# EAGLE design Si4455 Breakout (EAGLE 6.4)
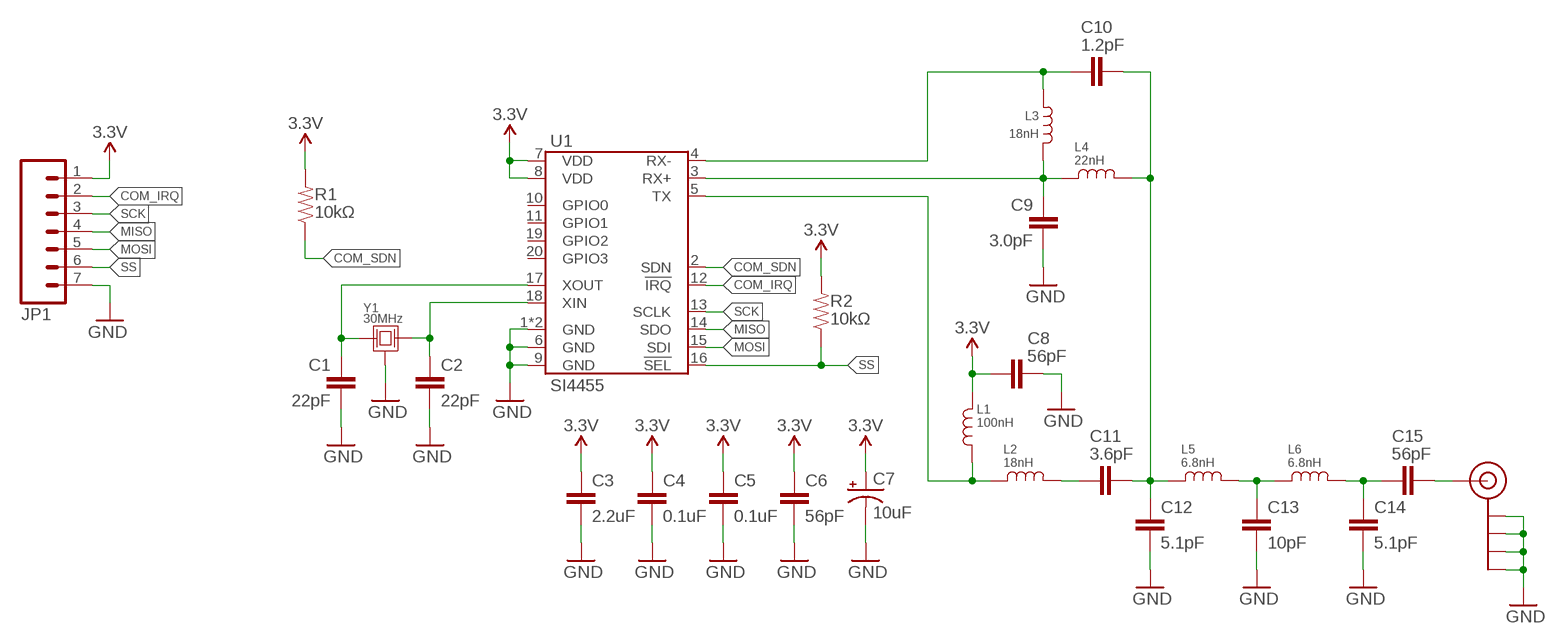
[diagram p0: schematic, sheet 1]

## Parts
C1  22pF  CAP-0402  [0402-CAP]
C2  22pF  CAP-0402  [0402-CAP]
C3  2.2uF  CAP-0402  [0402-CAP]
C4  0.1uF  CAP-0402  [0402-CAP]
C5  0.1uF  CAP-0402  [0402-CAP]
C6  56pF  CAP-0402  [0402-CAP]
C7  10uF  CAP_POL0805  [0805-CAP_POL]
C8  56pF  CAP-0402  [0402-CAP]
C9  3.0pF  CAP-0402  [0402-CAP]
C10  1.2pF  CAP-0402  [0402-CAP]
C11  3.6pF  CAP-0402  [0402-CAP]
C12  5.1pF  CAP-0402  [0402-CAP]
C13  10pF  CAP-0402  [0402-CAP]
C14  5.1pF  CAP-0402  [0402-CAP]
C15  56pF  CAP-0402  [0402-CAP]
J$1  SMA_EDGE  [SMA-EDGE]
JP1  M07  [1X07]
L1  100nH  INDUCTOR-0402  [0402-INDUCTOR]
L2  18nH  INDUCTOR-0402  [0402-INDUCTOR]
L3  18nH  INDUCTOR-0402  [0402-INDUCTOR]
L4  22nH  INDUCTOR-0402  [0402-INDUCTOR]
L5  6.8nH  INDUCTOR-0402  [0402-INDUCTOR]
L6  6.8nH  INDUCTOR-0402  [0402-INDUCTOR]
R1  10kΩ  RESISTOR  [0402-RES]
R2  10kΩ  RESISTOR  [0402-RES]
U1  SI4455  [SI4455]
Y1  30MHz  CRYSTAL-3.2X2.5  [FA-238]

## Nets
3.3V: C3.1 C4.1 C5.1 C6.1 C7.A(+) C8.1 JP1.1 L1.2 R1.2 R2.2 U1.7(VDD) U1.8(VDD)
COM_IRQ: JP1.2 U1.12(!IRQ)
COM_SDN: R1.1 U1.2(SDN)
GND: C1.2 C2.2 C3.2 C4.2 C5.2 C6.2 C7.C(-) C8.2 C9.2 C12.2 C13.2 C14.2 J$1.GND@0(GND) J$1.GND@1(GND) J$1.GND@2(GND) J$1.GND@3(GND) JP1.7 U1.1(GND) U1.6(GND) U1.9(GND) U1.EP(GND) Y1.2(GND) Y1.4(GND)
MISO: JP1.4 U1.14(SDO)
MOSI: JP1.5 U1.15(SDI)
N$3 [rf]: C15.2 J$1.SIG(SIGNAL)
N$5 [rf]: C14.1 C15.1 L6.2
N$6 [rf]: C13.1 L5.2 L6.1
N$8 [rf]: C11.1 L2.2
N$9: L1.1 L2.1 U1.5(TX)
N$10: C10.1 L3.2 U1.4(RX-)
N$11: C1.1 U1.17(XOUT) Y1.1
N$12: C2.1 U1.18(XIN) Y1.3
N$13: C9.1 L3.1 L4.1 U1.3(RX+)
N$14 [rf]: C10.2 C11.2 C12.1 L4.2 L5.1
SCK: JP1.3 U1.13(SCLK)
SS: JP1.6 R2.1 U1.16(!SEL)
Unconnected: U1.10(GPIO0) U1.11(GPIO1) U1.19(GPIO2) U1.20(GPIO3)

## Library data of the parts
C1-C6 C8-C15 = Passives:CAP
C7 = SparkFun-Passives:CAP_POL: Capacitor Polarized These are standard SMD and PTH capacitors. Normally 10uF, 47uF, and 100uF in electrolytic and tantalum varieties. Always verify the external diameter of the through hole cap, it varies with capacity, voltage, and manufacturer. The EIA devices should be standard.
J$1 = SparkFun-Connectors:SMA_EDGE: SMA Antenna Connector End launch SMA connector. The paste layer has been removed so that the connector can be hand soldered onto the board after reflow.
JP1 = SparkFun-Connectors:M07: Header 7 Standard 7-pin 0.1" header. Use with straight break away headers (SKU : PRT-00116), right angle break away headers (PRT-00553), swiss pins (PRT-00743), machine pins (PRT-00117), and female headers (PRT-00115). NOTES ON THE VARIANTS LOCK and LOCK_LONGPADS... This footprint was designed to help hold the alignment of a through-hole component (i.e. 7-pin header) while soldering it into place. You may notice that each hole has been shifted either up or down by 0.005 of an inch from it's more standard position (which is usually a perfectly straight line). This slight alteration caused the pins (the squares in the middle) to touch the edges of the holes. Because they are alternating, it causes a "brace" to hold the header in place. 0.005 has proven to be the perfect amount of "off-center" position when using our standard breakaway headers. Although looks a little odd when you look at the bare footprint, once you have a header in there, the alteration is very hard to notice. Also, if you push a header all the way into place, it is covered up entirely on the bottom side. This idea of altering the position of holes to aid alignment will be further integrated into the Sparkfun Library for other footprints. It can help hold any component with 3 or more connection pins.
L1-L6 = Passives:INDUCTOR
R1 R2 = Passives:RESISTOR
U1 = Silicon Labs:SI4455
Y1 = Passives:CRYSTAL

## Net classes
1 rf: width 0.584 mm, drill 0.406 mm, clearance 0.4 mm

## Board
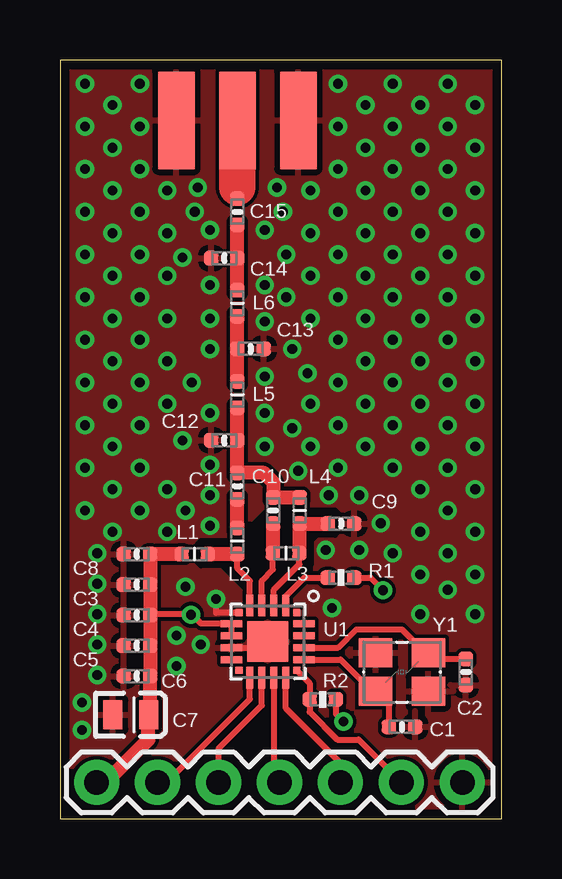
[diagram p1: board, top side]
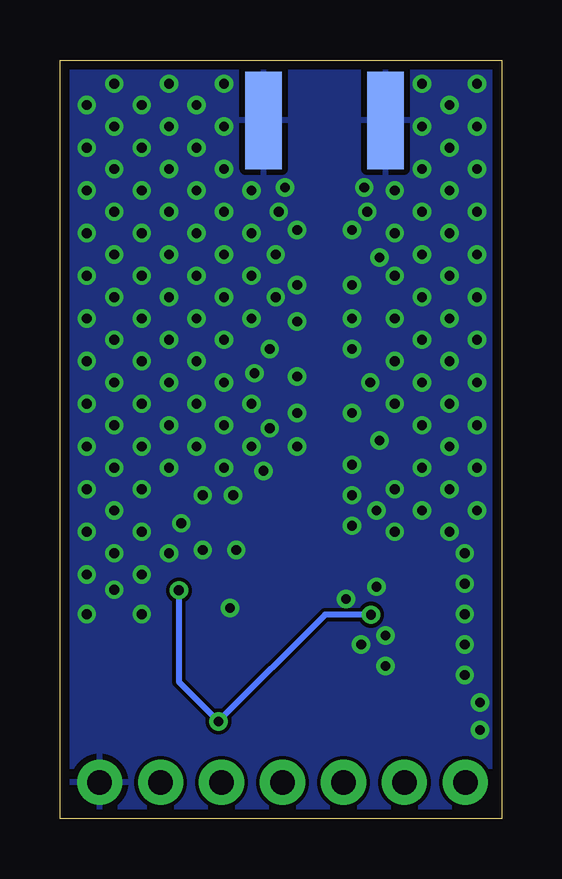
[diagram p2: board, bottom side, seen from below]

Size 18.41 x 31.62 mm. Coordinates in mm from the lower left corner, seen from the top.
Outline: 0,0 18.41,0 18.41,31.62 0,31.62 0,0
Copper layers (1*16): Top 0.0356mm / dielectric 1.5011mm / Bottom 0.0356mm
Design rules "LaenPCBOrder *": minimum track width 6mil, minimum drill 13mil, track to track 6mil, track to pad 6mil, pad to pad 6mil, via to via 6mil, smd to smd 6mil, copper to edge 15mil, drill to drill 6mil, minimum pad ring 7mil, minimum via ring 7mil, stop-mask expansion 4mil, vias tented up to drill 17mil, thermal gap 10mil

### Footprints (pad centres in the part's own frame; a part is rotated, then mirrored left to right if it is on the bottom)
0402-CAP = smd 0.6 x 0.6: 1 -0.55,0; 2 0.55,0
0805-CAP_POL = smd 0.8 x 1.2: A 0.75,0; C -0.75,0
SMA-EDGE = smd 1.524 x 4.064: GND@0 0,0; GND@1 5.08,0; SIG 2.54,0 | smd 1.524 x 4.064 bottom: GND@2 0,0; GND@3 5.08,0
1X07 = drill 1.016 pad 1.88: 1 0,0; 2 2.54,0; 3 5.08,0; 4 7.62,0; 5 10.16,0; 6 12.7,0; 7 15.24,0
0402-INDUCTOR = smd 0.6 x 0.6: 1 -0.55,0; 2 0.55,0
0402-RES = smd 0.6 x 0.6: 1 -0.55,0; 2 0.55,0
SI4455 = smd 0.3 x 0.3: 1 -1.2,1.2; 6 -1.2,-1.2; 11 1.2,-1.2; 16 1.2,1.2 | smd 0.9 x 0.29: 2 -1.51,0.75; 3 -1.51,0.25; 4 -1.51,-0.25; 5 -1.51,-0.75; 12 1.51,-0.75; 13 1.51,-0.25; 14 1.51,0.25; 15 1.51,0.75 | smd 0.29 x 0.9: 7 -0.75,-1.51; 8 -0.25,-1.51; 9 0.25,-1.51; 10 0.75,-1.51; 17 0.75,1.51; 18 0.25,1.51; 19 -0.25,1.51; 20 -0.75,1.51 | smd 1.7 x 1.7: EP 0,0
FA-238 = smd 1.4 x 1.2: 1 -1.1,-0.8; 2 1.1,-0.8; 3 1.1,0.8; 4 -1.1,0.8

### Placement (x,y rotation side)
C1  14.25,3.84 0 top
C2  16.92,6.12 270 top
C3  3.2,9.77 180 top
C4  3.2,8.5 180 top
C5  3.2,7.23 180 top
C6  3.2,5.96 180 top
C7  2.95,4.34 0 top
C8  3.2,11.04 180 top
C9  11.71,12.31 0 top
C10  8.88,12.85 90 top
C11  7.39,13.87 90 top
C12  6.85,15.77 180 top
C13  7.94,19.58 0 top
C14  6.85,23.37 180 top
C15  7.39,25.3 90 top
J$1  4.85,29.11 0 top
JP1  1.52,1.52 0 top
L1  5.61,11.04 180 top
L2  7.39,11.58 90 top
L3  9.42,11.07 180 top
L4  9.98,12.85 90 top
L5  7.39,17.68 90 top
L6  7.39,21.49 90 top
R1  11.71,10.06 0 top
R2  10.95,4.98 0 top
U1  8.66,7.39 270 top
Y1  14.25,6.12 0 top

### Tracks (layer width: path | path; a pad name or v marks a point on that pad's centre or on a via)
3.3V  (via drill 0.41)
  Top 0.254: 5.49,8.53 5.88,8.14 U1.7 U1.8 | 5.49,8.53 3.79,8.53 C4.1 | R2.2 11.5,4.38 v11.81,4.06 | R1.2 12.93,10.06 v13.46,9.53 | 5.49,8.53 v5.46,8.51
  Top 0.584: L1.2 C8.1 C3.1 C4.1 C5.1 C6.1 3.75,4.4 C7.A 3.68,4.33 3.68,3.3 1.91,1.52 JP1.1
  Bottom 0.254: v13.46,9.53 13.46,5.71 v11.81,4.06 7.37,8.51 v5.46,8.51
COM_IRQ
  Top 0.254: U1.12 7.91,4.99 4.45,1.52 JP1.2
COM_SDN
  Top 0.254: U1.2 9.41,9.28 10.19,10.06 R1.1
GND  (via drill 0.41)
  Top 0.254: U1.6 6.5,8.59 v6.5,9.17 | U1.9 8.41,7.14 U1.EP
  other vias: 5.23,9.68 9.04,26.31 5.74,26.31 6.25,24.54 8.53,24.54 8.53,22.25 6.25,22.25 5.11,23.39 8.53,20.73 9.68,19.58 6.25,19.58 8.53,18.44 8.53,16.92 6.25,16.92 5.11,15.77 8.53,15.52 9.93,14.5 11.2,13.49 12.47,13.49 13.36,12.32 12.47,11.2 11.07,11.2 5.87,7.26 4.85,7.65 4.85,6.38 1.55,5.99 1.55,7.26 1.55,8.53 1.55,9.8 1.55,11.07 2.18,11.96 4.47,13.74 6.25,12.22 6.25,14.76 3.33,30.63 3.33,28.85 3.33,27.08 4.47,26.19 10.44,26.19 11.33,8.79 15.01,8.53 6.25,13.49 1.04,30.63 1.04,28.85 1.04,27.08 2.18,29.74 2.18,27.97 1.04,25.3 3.33,25.3 2.18,26.19 13.87,30.63 13.87,28.85 13.87,27.08 11.58,30.63 11.58,28.85 11.58,27.08 12.73,29.74 12.73,27.97 11.58,25.3 13.87,25.3 12.73,26.19 16.15,30.63 16.15,28.85 16.15,27.08 15.01,29.74 15.01,27.97 16.15,25.3 15.01,26.19 17.3,29.74 17.3,27.97 17.3,26.19 9.3,25.3 10.44,24.41 12.73,24.41 15.01,24.41 17.3,24.41 4.47,24.41 5.61,25.3 2.18,24.41 3.33,23.52 1.04,23.52 2.18,22.63 4.47,22.63 2.18,20.85 1.04,21.74 3.33,21.74 1.04,19.96 4.47,20.85 2.18,19.08 4.47,19.08 3.33,19.96 6.25,20.85 3.33,18.19 1.04,18.19 2.18,17.3 4.47,17.3 5.49,18.19 3.33,16.41 1.04,16.41 2.18,15.52 3.33,14.63 1.04,14.63 2.18,13.74 1.04,12.85 3.33,12.85 4.47,11.96 5.23,12.85 17.3,10.19 17.3,11.96 16.15,11.07 13.87,11.07 15.01,11.96 17.3,22.63 16.15,23.52 13.87,23.52 11.58,23.52 9.42,23.52 15.01,22.63 12.73,22.63 10.44,22.63 16.15,21.74 13.87,21.74 11.58,21.74 9.42,21.74 16.15,12.85 17.3,13.74 17.3,15.52 17.3,17.3 17.3,19.08 17.3,20.85 15.01,20.85 16.15,19.96 16.15,18.19 16.15,16.41 16.15,14.63 15.01,13.74 15.01,15.52 15.01,17.3 15.01,19.08 12.73,20.85 10.44,20.85 13.87,19.96 11.58,19.96 12.73,19.08 13.87,18.19 13.87,16.41 13.87,14.63 12.73,17.3 12.73,15.52 11.58,18.19 11.58,16.41 11.58,14.63 10.44,17.3 10.44,15.52 10.31,18.57 9.68,16.28 15.01,10.19 16.15,9.55 17.3,8.53 0.91,4.85 0.91,3.71
  pour Top: -1.27,-1.27 19.56,-1.27 19.56,32.89 -1.27,32.89
  pour Bottom: -2.54,34.16 20.83,34.16 20.83,-2.54 -2.54,-2.54
MISO
  Top 0.254: U1.14 8.91,1.75 JP1.4
MOSI
  Top 0.254: U1.15 9.41,4.61 11.68,2.34 JP1.5
N$3
  Top 0.584: C15.2 7.39,26.31
  Top 1.511: 7.39,26.31 J$1.SIG
N$5
  Top 0.584: L6.2 C14.1 C15.1
N$6
  Top 0.584: L5.2 C13.1 L6.1
N$7
  cutout Top: 5.87,11.58 7.39,11.58 8.66,12.85 11.46,12.85 11.71,12.6 11.71,12.09 11.46,11.84 10.69,11.84 10.44,11.58 10.44,10.57 9.3,9.42 7.9,9.42 6.76,10.57 5.87,10.57 5.61,10.82 5.61,11.33
N$8
  Top 0.584: L2.2 C11.1
N$9
  Top 0.254: U1.5 7.91,9.92 7.39,10.44 L2.1
  Top 0.584: L2.1 L1.1
N$10
  Top 0.254: U1.4 8.41,9.94 8.87,10.4 L3.2
  Top 0.584: C10.1 L3.2
N$11
  Top 0.254: U1.17 11.7,6.64 12.6,5.74 12.73,5.74 Y1.1 13.7,4.77 C1.1
N$12
  Top 0.254: U1.18 11.59,7.14 12.34,7.9 14.25,7.9 14.88,7.26 15.01,7.26 Y1.3 15.6,6.67 C2.1
N$13
  Top 0.254: U1.3 8.91,9.55 9.97,10.61 L3.1
  Top 0.584: L3.1 L4.1 C9.1
N$14
  Top 0.584: L4.2 C10.2 8.88,14.03 8.49,14.42 C11.2 C12.1 L5.1
SCK
  Top 0.254: U1.13 8.41,4.73 6.6,2.92 JP1.3
SS
  Top 0.254: U1.16 10.4,5.66 R2.1 10.4,4.46 11.56,3.3 12.45,3.3 JP1.6